# EAGLE design PIC-adresseur (EAGLE 7.2.0)
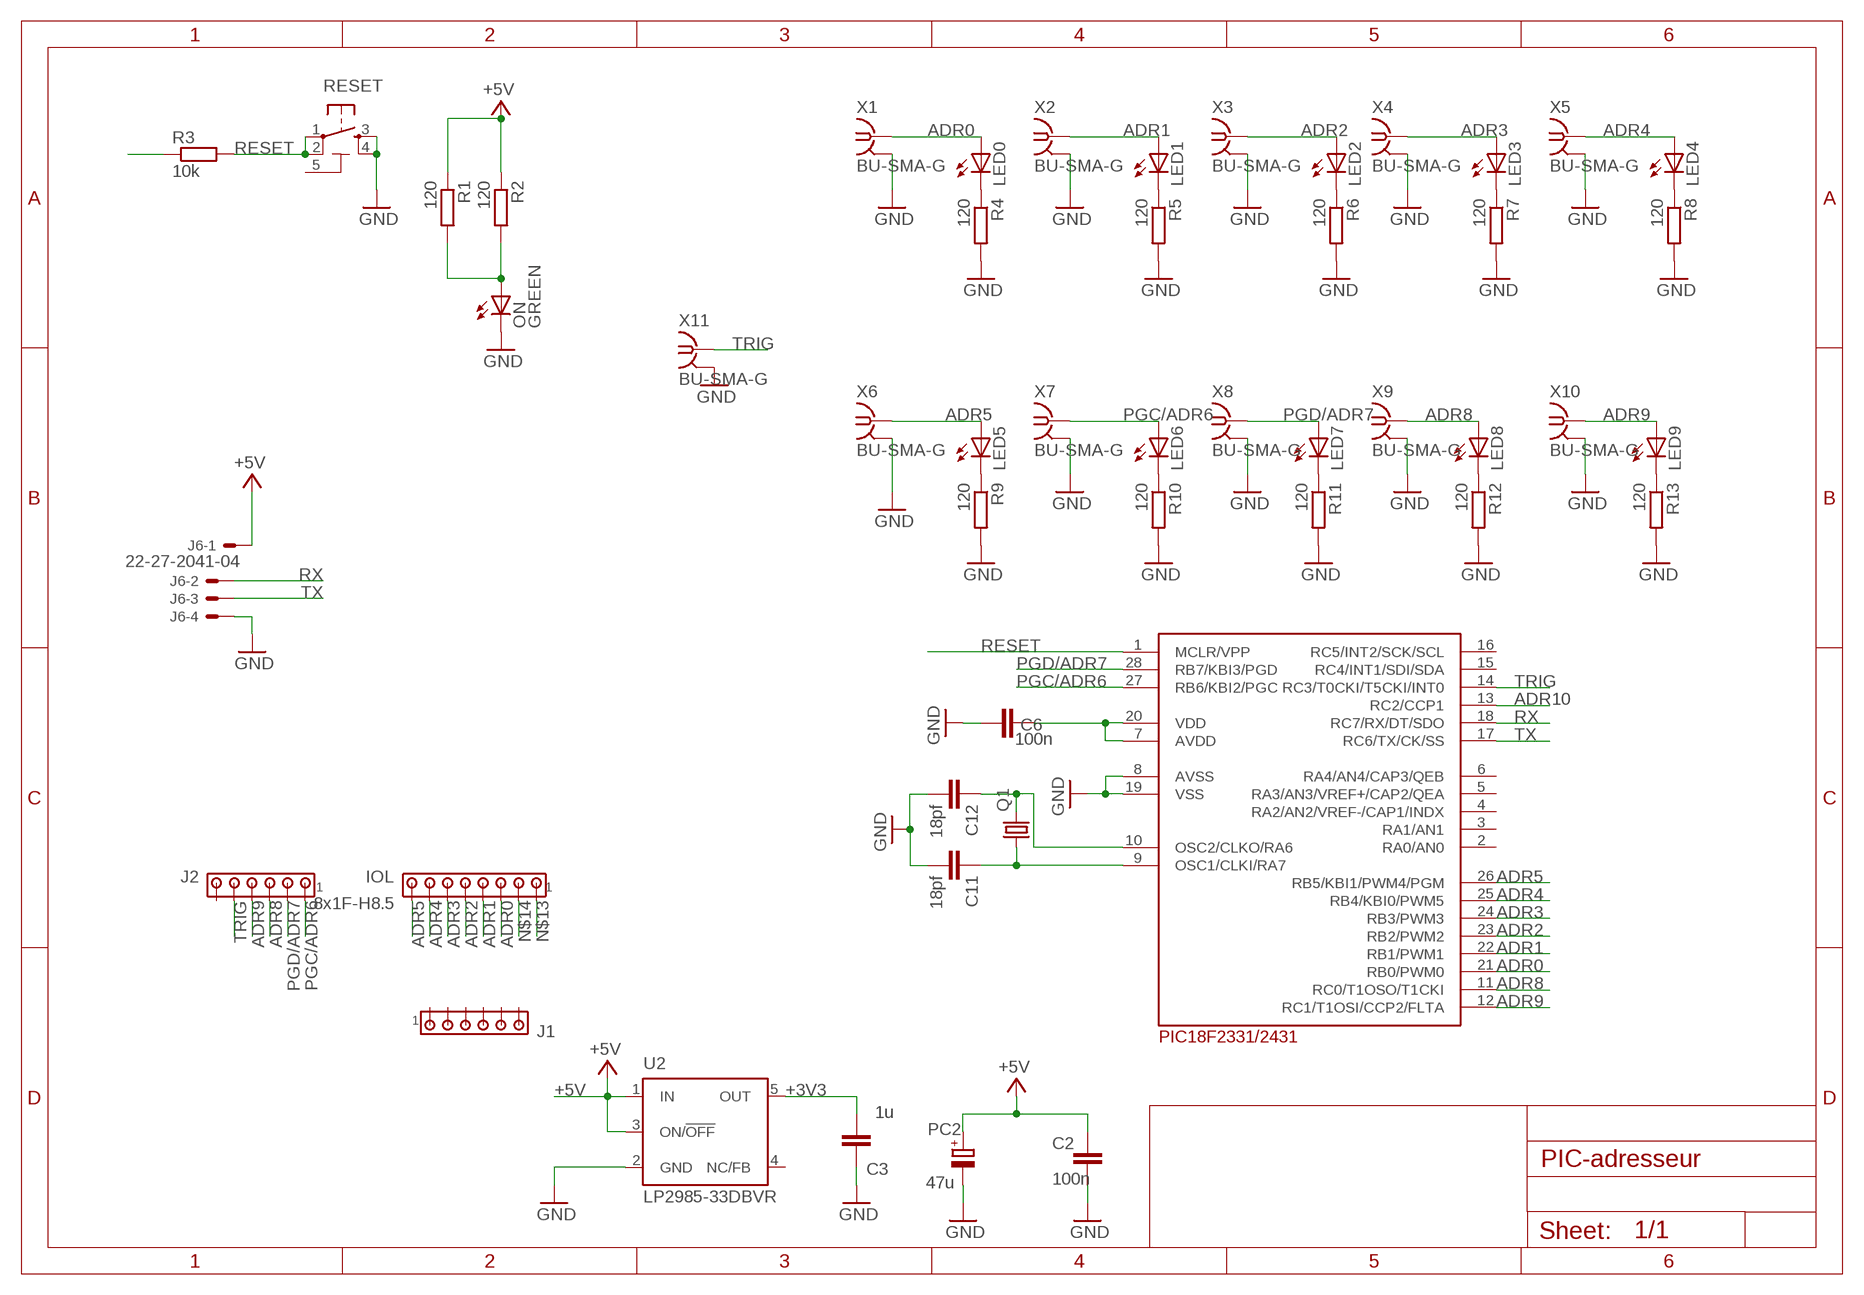
[diagram p0: schematic, sheet 1]

## Parts
C2  100n  C-EU0603-RND  [C0603-ROUND]
C3  1u  C-EU0603-RND  [C0603-ROUND]
C6  100n  C-EUC0603K  [C0603K]
C11  18pf  C-EUC0603  [C0603]
C12  18pf  C-EUC0603  [C0603]
IOL  8x1F-H8.5  MTA08-100  [10X08MTA]
J1  MTA06-100  [10X06MTA]
J2  MTA06-100  [10X06MTA]
J6  22-27-2041-04  [6410-04]
LED0  LEDCHIP-LED0805  [CHIP-LED0805]
LED1  LEDCHIP-LED0805  [CHIP-LED0805]
LED2  LEDCHIP-LED0805  [CHIP-LED0805]
LED3  LEDCHIP-LED0805  [CHIP-LED0805]
LED4  LEDCHIP-LED0805  [CHIP-LED0805]
LED5  LEDCHIP-LED0805  [CHIP-LED0805]
LED6  LEDCHIP-LED0805  [CHIP-LED0805]
LED7  LEDCHIP-LED0805  [CHIP-LED0805]
LED8  LEDCHIP-LED0805  [CHIP-LED0805]
LED9  LEDCHIP-LED0805  [CHIP-LED0805]
ON  GREEN  LEDCHIP-LED0805  [CHIP-LED0805]
PC2  47u  CPOL-EUD  [PANASONIC_D]
Q1  CRYSTALSM49  [SM49]
R1  120  R-EU_R0805  [R0805]
R2  120  R-EU_R0805  [R0805]
R3  10k  R-EU_R0805  [R0805]
R4  120  R-EU_R0805  [R0805]
R5  120  R-EU_R0805  [R0805]
R6  120  R-EU_R0805  [R0805]
R7  120  R-EU_R0805  [R0805]
R8  120  R-EU_R0805  [R0805]
R9  120  R-EU_R0805  [R0805]
R10  120  R-EU_R0805  [R0805]
R11  120  R-EU_R0805  [R0805]
R12  120  R-EU_R0805  [R0805]
R13  120  R-EU_R0805  [R0805]
RESET  TS42031-160R-TR-7260  TS42  [TS42]
U2  LP2985-33DBVR  LP2985-XXDBVR33  [SOT23-DBV]
U$2  PIC18F2331/2431  [DIL28-3]
X1  BU-SMA-G  [BU-SMA-G]
X2  BU-SMA-G  [BU-SMA-G]
X3  BU-SMA-G  [BU-SMA-G]
X4  BU-SMA-G  [BU-SMA-G]
X5  BU-SMA-G  [BU-SMA-G]
X6  BU-SMA-G  [BU-SMA-G]
X7  BU-SMA-G  [BU-SMA-G]
X8  BU-SMA-G  [BU-SMA-G]
X9  BU-SMA-G  [BU-SMA-G]
X10  BU-SMA-G  [BU-SMA-G]
X11  BU-SMA-G  [BU-SMA-G]

## Nets
+3V3: C3.2 C6.2 R3.1 U2.5(OUT) U$2.7(AVDD) U$2.20(VDD)
+5V [usbvcc]: C2.2 J6.1 PC2.+ R1.1 R2.1 U2.1(IN) U2.3(ON/!OFF)
ADR0: IOL.3 LED0.A U$2.21(RB0/PWM0) X1.1
ADR1: IOL.4 LED1.A U$2.22(RB1/PWM1) X2.1
ADR2: IOL.5 LED2.A U$2.23(RB2/PWM2) X3.1
ADR3: IOL.6 LED3.A U$2.24(RB3/PWM3) X4.1
ADR4: IOL.7 LED4.A U$2.25(RB4/KBI0/PWM5) X5.1
ADR5: IOL.8 LED5.A U$2.26(RB5/KBI1/PWM4/PGM) X6.1
ADR8: J2.4 LED8.A U$2.11(RC0/T1OSO/T1CKI) X9.1
ADR9: J2.3 LED9.A U$2.12(RC1/T1OSI/CCP2/FLTA) X10.1
ADR10: U$2.13(RC2/CCP1)
GND [gnd]: C2.1 C3.1 C6.1 C11.2 C12.2 J6.4 ON.C PC2.- R4.2 R5.2 R6.2 R7.2 R8.2 R9.2 R10.2 R11.2 R12.2 R13.2 RESET.3 RESET.4 U2.2(GND) U$2.8(AVSS) U$2.19(VSS) X1.2 X1.3 X1.4 X1.5 X2.2 X2.3 X2.4 X2.5 X3.2 X3.3 X3.4 X3.5 X4.2 X4.3 X4.4 X4.5 X5.2 X5.3 X5.4 X5.5 X6.2 X6.3 X6.4 X6.5 X7.2 X7.3 X7.4 X7.5 X8.2 X8.3 X8.4 X8.5 X9.2 X9.3 X9.4 X9.5 X10.2 X10.3 X10.4 X10.5 X11.2 X11.3 X11.4 X11.5
N$1: LED0.C R4.1
N$2: LED1.C R5.1
N$3: ON.A R1.2 R2.2
N$4: LED2.C R6.1
N$5: LED3.C R7.1
N$7: LED4.C R8.1
N$8: LED5.C R9.1
N$9: LED6.C R10.1
N$10: LED7.C R11.1
N$11: LED8.C R12.1
N$12: LED9.C R13.1
N$13: IOL.1
N$14: IOL.2
PGC/ADR6: J2.6 LED6.A U$2.27(RB6/KBI2/PGC) X7.1
PGD/ADR7: J2.5 LED7.A U$2.28(RB7/KBI3/PGD) X8.1
RESET: R3.2 RESET.1 RESET.2 U$2.1(MCLR/VPP)
RX: J6.2 U$2.18(RC7/RX/DT/SDO)
TRIG: J2.2 U$2.14(RC3/T0CKI/T5CKI/INT0) X11.1
TX: J6.3 U$2.17(RC6/TX/CK/SS)
XTAL1: C12.1 Q1.2 U$2.10(OSC2/CLKO/RA6)
XTAL2: C11.1 Q1.1 U$2.9(OSC1/CLKI/RA7)
Unconnected: J1.1 J1.2 J1.3 J1.4 J1.5 J1.6 J2.1 U2.4(NC/FB) U$2.2(RA0/AN0) U$2.3(RA1/AN1) U$2.4(RA2/AN2/VREF-/CAP1/INDX) U$2.5(RA3/AN3/VREF+/CAP2/QEA) U$2.6(RA4/AN4/CAP3/QEB) U$2.15(RC4/INT1/SDI/SDA) U$2.16(RC5/INT2/SCK/SCL)

## Power pins joined to a net without a drawn wire
5-GND: RESET.5(5-GND)

## Library data of the parts
C2 C6 = SmartPrj:C-EU: CAPACITOR, European symbol; OC_FARNELL: 2210925
C3 = SmartPrj:C-EU: CAPACITOR, European symbol; OC_FARNELL: 2346901
C11 C12 = LibPerso:C-EU: CAPACITOR, European symbol; OC_FARNELL: 1740598
IOL = LibPerso:MTA08-100: AMP connector; OC_FARNELL: 1593416
J1 J2 = LibPerso:MTA06-100: AMP connector; OC_FARNELL: 1593415
J6 = con-molex:22-?-04: CONNECTOR wire to board 2.54 mm (.1 inch) pitch header; OC_FARNELL: unknown; OC_NEWARK: unknown
LED0 LED1-LED9 = LibPerso:LED: LED OSRAM: - CHIPLED LG R971, LG N971, LY N971, LG Q971, LY Q971, LO R971, LY R971 LH N974, LH R974 LS Q976, LO Q976, LY Q976 LO Q996 - Hyper CHIPLED LW Q18S LB Q993, LB Q99A, LB R99A - SideLED LS A670, LO A670, LY A670, LG A670, LP A670 LB A673, LV A673, LT A673, LW A673 LH A674 LY A675 LS A676, LA A676, LO A676, LY A676, LW A676 LS A679, LY A679, LG A679 - Hyper Micro SIDELED® LS Y876, LA Y876, LO Y876, LY Y876 LT Y87S - SmartLED LW L88C, LW L88S LB L89C, LB L89S, LG L890 LS L89K, LO L89K, LY L89K LS L896, LA L896, LO L896, LY L896 - TOPLED LS T670, LO T670, LY T670, LG T670, LP T670 LSG T670, LSP T670, LSY T670, LOP T670, LYG T670 LG T671, LOG T671, LSG T671 LB T673, LV T673, LT T673, LW T673 LH T674 LS T676, LA T676, LO T676, LY T676, LB T676, LH T676, LSB T676, LW T676 LB T67C, LV T67C, LT T67C, LS T67K, LO T67K, LY T67K, LW E67C LS E67B, LA E67B, LO E67B, LY E67B, LB E67C, LV E67C, LT E67C LW T67C LS T679, LY T679, LG T679 LS T770, LO T770, LY T770, LG T770, LP T770 LB T773, LV T773, LT T773, LW T773 LH T774 LS E675, LA E675, LY E675, LS T675 LS T776, LA T776, LO T776, LY T776, LB T776 LHGB T686 LT T68C, LB T68C - Hyper Mini TOPLED® LB M676 - Mini TOPLED Santana® LG M470 LS M47K, LO M47K, LY M47K Source: http://www.osram.convergy.de LUXEON: - LUMILED® LXK2-PW12-R00, LXK2-PW12-S00, LXK2-PW14-U00, LXK2-PW14-V00 LXK2-PM12-R00, LXK2-PM12-S00, LXK2-PM14-U00 LXK2-PE12-Q00, LXK2-PE12-R00, LXK2-PE12-S00, LXK2-PE14-T00, LXK2-PE14-U00 LXK2-PB12-K00, LXK2-PB12-L00, LXK2-PB12-M00, LXK2-PB14-N00, LXK2-PB14-P00, LXK2-PB14-Q00 LXK2-PR12-L00, LXK2-PR12-M00, LXK2-PR14-Q00, LXK2-PR14-R00 LXK2-PD12-Q00, LXK2-PD12-R00, LXK2-PD12-S00 LXK2-PH12-R00, LXK2-PH12-S00 LXK2-PL12-P00, LXK2-PL12-Q00, LXK2-PL12-R00 Source: www.luxeon.com KINGBRIGHT: KA-3528ASYC Source: www.kingbright.com; OC_FARNELL: 8529906
ON = led:LED: LED OSRAM: - CHIPLED LG R971, LG N971, LY N971, LG Q971, LY Q971, LO R971, LY R971 LH N974, LH R974 LS Q976, LO Q976, LY Q976 LO Q996 - Hyper CHIPLED LW Q18S LB Q993, LB Q99A, LB R99A - SideLED LS A670, LO A670, LY A670, LG A670, LP A670 LB A673, LV A673, LT A673, LW A673 LH A674 LY A675 LS A676, LA A676, LO A676, LY A676, LW A676 LS A679, LY A679, LG A679 - Hyper Micro SIDELED® LS Y876, LA Y876, LO Y876, LY Y876 LT Y87S - SmartLED LW L88C, LW L88S LB L89C, LB L89S, LG L890 LS L89K, LO L89K, LY L89K LS L896, LA L896, LO L896, LY L896 - TOPLED LS T670, LO T670, LY T670, LG T670, LP T670 LSG T670, LSP T670, LSY T670, LOP T670, LYG T670 LG T671, LOG T671, LSG T671 LB T673, LV T673, LT T673, LW T673 LH T674 LS T676, LA T676, LO T676, LY T676, LB T676, LH T676, LSB T676, LW T676 LB T67C, LV T67C, LT T67C, LS T67K, LO T67K, LY T67K, LW E67C LS E67B, LA E67B, LO E67B, LY E67B, LB E67C, LV E67C, LT E67C LW T67C LS T679, LY T679, LG T679 LS T770, LO T770, LY T770, LG T770, LP T770 LB T773, LV T773, LT T773, LW T773 LH T774 LS E675, LA E675, LY E675, LS T675 LS T776, LA T776, LO T776, LY T776, LB T776 LHGB T686 LT T68C, LB T68C - Hyper Mini TOPLED® LB M676 - Mini TOPLED Santana® LG M470 LS M47K, LO M47K, LY M47K Source: http://www.osram.convergy.de LUXEON: - LUMILED® LXK2-PW12-R00, LXK2-PW12-S00, LXK2-PW14-U00, LXK2-PW14-V00 LXK2-PM12-R00, LXK2-PM12-S00, LXK2-PM14-U00 LXK2-PE12-Q00, LXK2-PE12-R00, LXK2-PE12-S00, LXK2-PE14-T00, LXK2-PE14-U00 LXK2-PB12-K00, LXK2-PB12-L00, LXK2-PB12-M00, LXK2-PB14-N00, LXK2-PB14-P00, LXK2-PB14-Q00 LXK2-PR12-L00, LXK2-PR12-M00, LXK2-PR14-Q00, LXK2-PR14-R00 LXK2-PD12-Q00, LXK2-PD12-R00, LXK2-PD12-S00 LXK2-PH12-R00, LXK2-PH12-S00 LXK2-PL12-P00, LXK2-PL12-Q00, LXK2-PL12-R00 Source: www.luxeon.com KINGBRIGHT: KA-3528ASYC Source: www.kingbright.com; OC_FARNELL: 8529906
PC2 = rcl:CPOL-EU: POLARIZED CAPACITOR, European symbol; OC_FARNELL: 1850100
Q1 = crystal:CRYSTAL: CRYSTAL; OC_FARNELL: 1842332; OC_NEWARK: unknown
R1-R3 = LibPerso:R-EU_: RESISTOR, European symbol; OC_FARNELL: 9331697
R4-R13 = LibPerso:R-EU_: RESISTOR, European symbol; OC_FARNELL: 2447561
RESET = SmartPrj:TS42: TS42 Dongnan Electronics Tact switch VDC 12V - 50mA; OC_FARNELL: 2060823
U2 = SmartPrj:LP2985-XXDBVR: ULTRALOW-POWER 50-mA LOW-DROPOUT LINEAR REGULATORS 50-mA Low-Dropout Regulator Source: http://focus.ti.com/lit/ds/symlink/tps77001.pdf; OC_FARNELL: 2395925
U$2 = LibPerso:PIC18F2331/2431; OC_FARNELL: 1212693
X1-X11 = con-coax:BU-SMA-G: FEMALE SMA CONNECTOR Radiall distributor RS 193-9117; OC_FARNELL: unknown; OC_NEWARK: unknown

## Net classes
0 default: width 0.254 mm, clearance 0.254 mm
1 power: width 0.61 mm, drill 0.61 mm, clearance 0.254 mm
2 gnd: width 0.305 mm, drill 0.559 mm, clearance 0.254 mm
3 usbvcc: width 0.508 mm, drill 0.61 mm, clearance 0.254 mm
4 aref: width 0.406 mm, drill 0.61 mm, clearance 0.254 mm

## Board
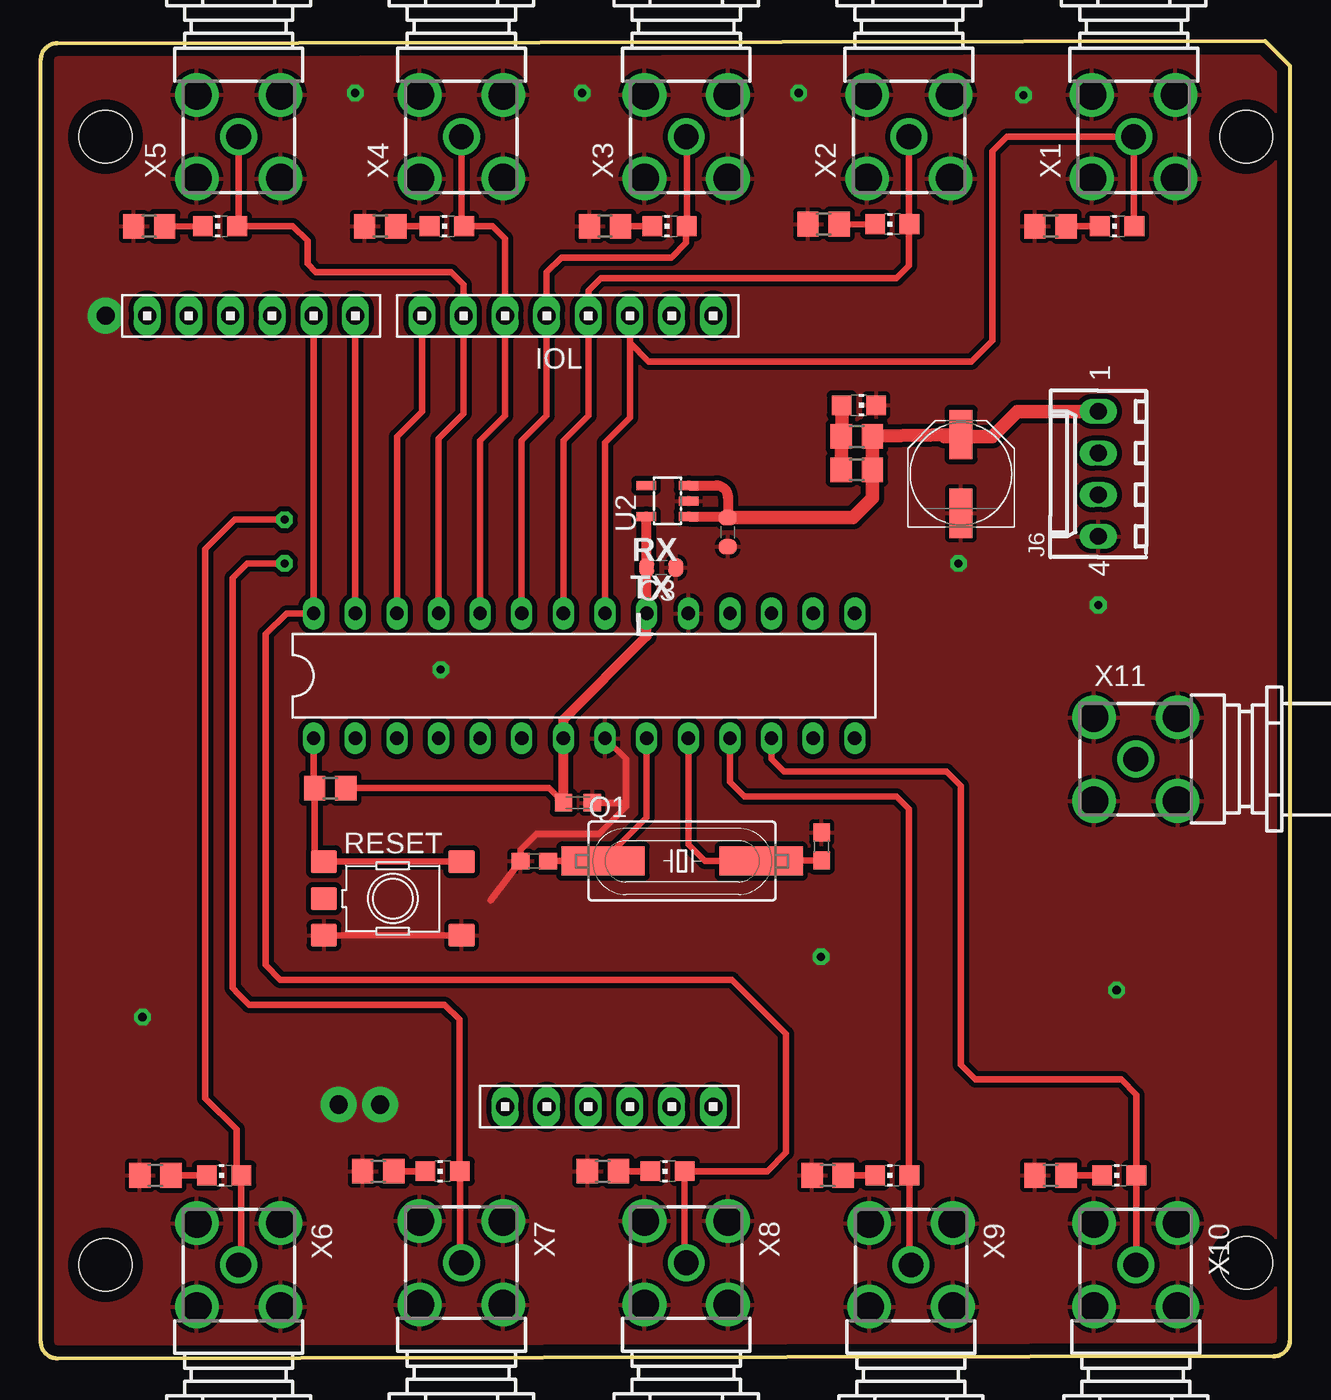
[diagram p1: board, top side]
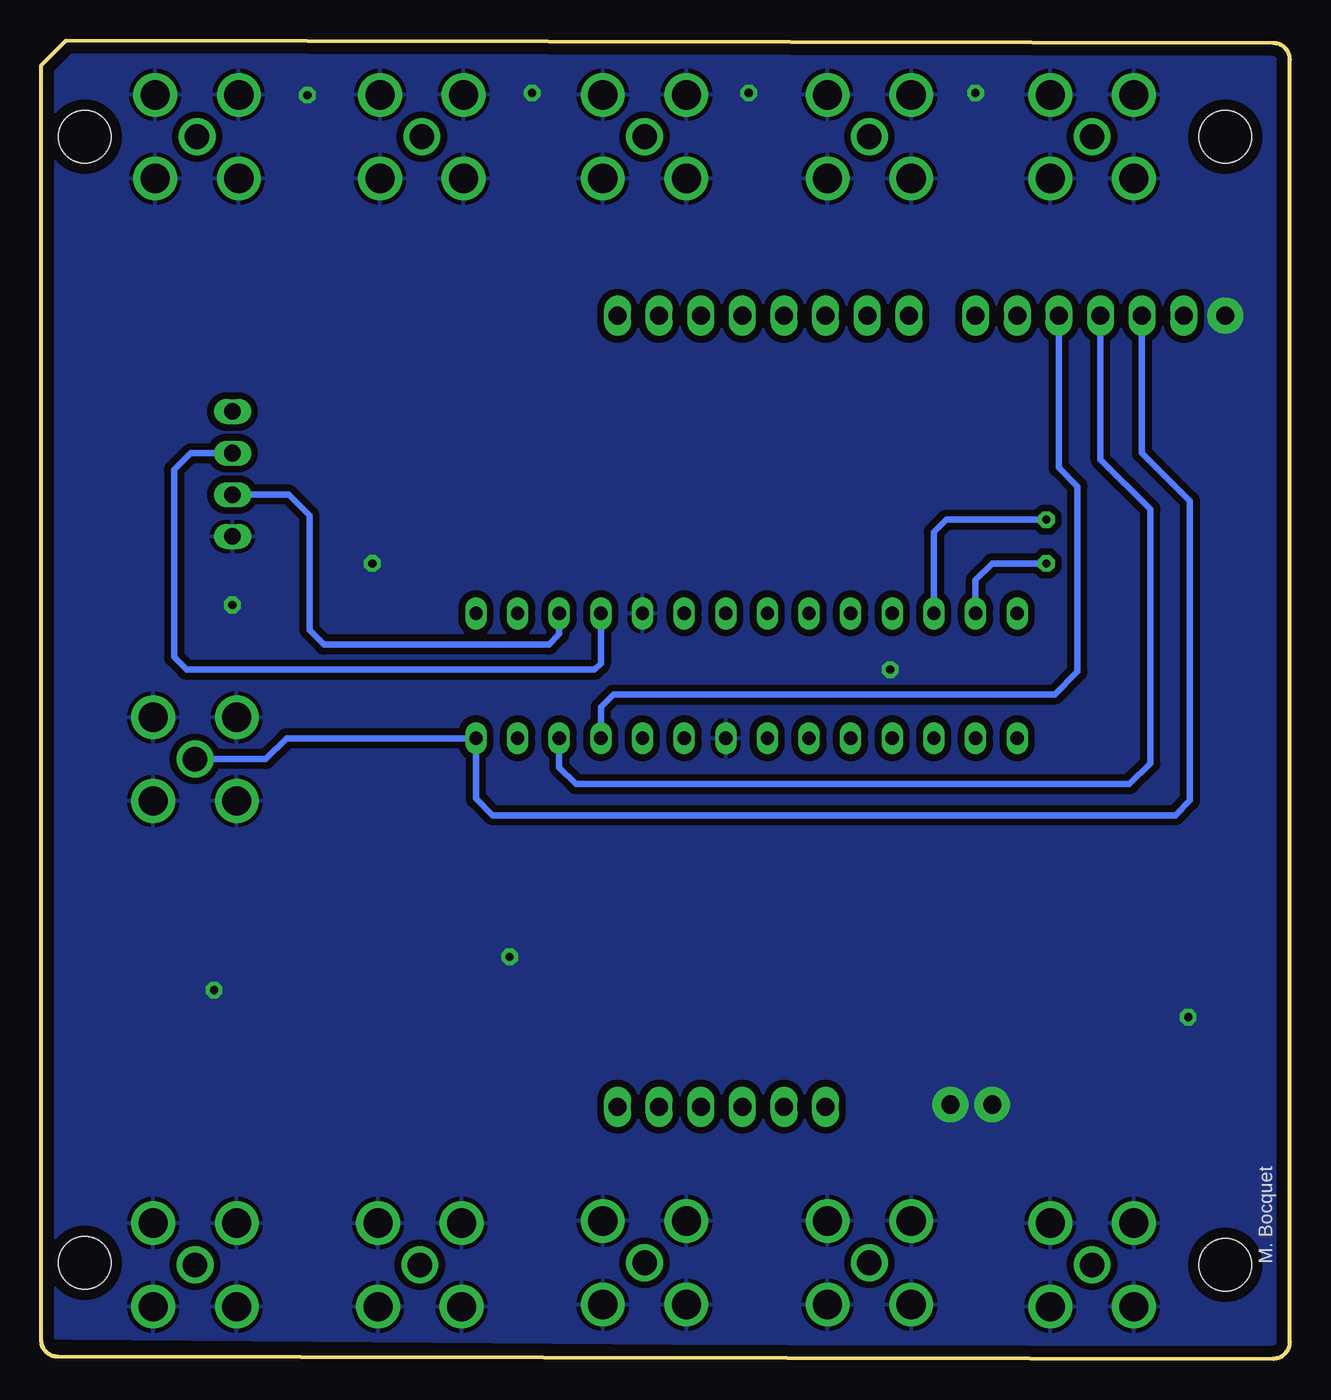
[diagram p2: board, bottom side, seen from below]

Size 76.2 x 80.39 mm. Coordinates in mm from the lower left corner, seen from the top.
Outline: 74.68,80.39 76.2,78.87 76.2,1.13 arc-90 75.2,0.13 1,0 arc-90 0,1 0,79.26 arc-90 1,80.26 74.68,80.39
Copper layers (1*16): Top 0.035mm / dielectric 1.5mm / Bottom 0.035mm
Design rules "default *": minimum track width 10mil, minimum drill 22mil, track to track 10mil, track to pad 10mil, pad to pad 10mil, via to via 12mil, smd to smd 8mil, copper to edge 26mil, drill to drill 12mil, minimum pad ring 10mil, minimum via ring 10mil, stop-mask expansion 1mil, vias tented up to drill 30mil, thermal gap 10mil
Holes 3.2 mm at 73.53,74.55 73.53,5.84 3.94,5.71 3.94,74.55

### Footprints (pad centres in the part's own frame; a part is rotated, then mirrored left to right if it is on the bottom)
C0603-ROUND = smd 0.898 x 1.1: 1 -0.889,0; 2 0.889,0
C0603K = smd 1.05 x 1.08: 1 -0.875,0; 2 0.875,0
C0603 = smd 1.1 x 1: 1 -0.85,0; 2 0.85,0
10X08MTA = drill 1.1 long: 1 8.89,0; 2 6.35,0; 3 3.81,0; 4 1.27,0; 5 -1.27,0; 6 -3.81,0; 7 -6.35,0; 8 -8.89,0
10X06MTA = drill 1.1 long: 1 6.35,0; 2 3.81,0; 3 1.27,0; 4 -1.27,0; 5 -3.81,0; 6 -6.35,0
6410-04 = drill 1.016 long: 1 3.81,0; 2 1.27,0; 3 -1.27,0; 4 -3.81,0
CHIP-LED0805 = smd 1.2 x 1.2: A 0,-1.05; C 0,1.05
PANASONIC_D = smd 3 x 1.4: + 2.4,0; - -2.4,0
SM49 = smd 5.08 x 1.778: 1 -4.826,0; 2 4.826,0
R0805 = smd 1.3 x 1.5: 1 -0.95,0; 2 0.95,0
TS42 = smd 1.6 x 1.4: 1 -4.2,2.25; 2 4.2,2.25; 3 -4.2,-2.25; 4 4.2,-2.25; 5 -4.2,0
SOT23-DBV = smd 0.55 x 1.2: 1 -0.95,-1.3; 2 0,-1.3; 3 0.95,-1.3; 4 0.95,1.3; 5 -0.95,1.3
DIL28-3 = drill 0.813 long: 1 -16.51,-3.81; 2 -13.97,-3.81; 3 -11.43,-3.81; 4 -8.89,-3.81; 5 -6.35,-3.81; 6 -3.81,-3.81; 7 -1.27,-3.81; 8 1.27,-3.81; 9 3.81,-3.81; 10 6.35,-3.81; 11 8.89,-3.81; 12 11.43,-3.81; 13 13.97,-3.81; 14 16.51,-3.81; 15 16.51,3.81; 16 13.97,3.81; 17 11.43,3.81; 18 8.89,3.81; 19 6.35,3.81; 20 3.81,3.81; 21 1.27,3.81; 22 -1.27,3.81; 23 -3.81,3.81; 24 -6.35,3.81; 25 -8.89,3.81; 26 -11.43,3.81; 27 -13.97,3.81; 28 -16.51,3.81
BU-SMA-G = drill 1.5: 1 0,0 | drill 1.778: 2 -2.55,2.55; 3 2.55,2.55; 4 2.55,-2.55; 5 -2.55,-2.55

### Placement (x,y rotation side)
C2  41.91,50.42 90 top
C3  37.85,48.26 180 top
C6  32.77,33.91 180 top
C11  30.1,30.35 180 top
C12  47.62,31.24 90 top
IOL  32.13,63.63 0 top
J1  34.67,15.37 0 top
J2  12.83,63.63 180 top
J6  64.52,53.98 90 top
LED0  65.66,69.09 90 top
LED1  51.94,69.22 90 top
LED2  38.35,69.09 90 top
LED3  24.77,69.09 90 top
LED4  10.92,69.09 90 top
LED5  11.18,11.18 90 top
LED6  24.51,11.43 90 top
LED7  38.23,11.43 90 top
LED8  51.94,11.18 90 top
LED9  65.79,11.18 90 top
ON  49.91,58.17 270 top
PC2  56.13,53.98 90 top
Q1  39.12,30.35 0 top
R1  49.78,56.26 180 top
R2  49.78,54.23 180 top
R3  17.65,34.8 180 top
R4  61.59,69.09 180 top
R5  47.75,69.22 180 top
R6  34.42,69.09 180 top
R7  20.7,69.09 180 top
R8  6.6,69.09 180 top
R9  6.99,11.18 180 top
R10  20.57,11.43 180 top
R11  34.29,11.43 180 top
R12  48.01,11.18 180 top
R13  61.59,11.18 180 top
RESET  21.46,28.07 0 top
U2  38.23,52.32 90 top
U$2  33.15,41.66 0 top
X1  66.67,74.55 90 top
X2  52.96,74.55 90 top
X3  39.37,74.55 90 top
X4  25.65,74.55 90 top
X5  12.07,74.55 90 top
X6  12.07,5.71 270 top
X7  25.65,5.84 270 top
X8  39.37,5.84 270 top
X9  53.09,5.71 270 top
X10  66.8,5.71 270 top
X11  66.8,36.58 0 top

### Tracks (layer width: path | path; a pad name or v marks a point on that pad's centre or on a via)
+3V3
  Top 0.406: R3.1 31,34.8 C6.2
  Top 0.61: C6.2 31.89,37.83 U$2.7 31.88,38.99 36.96,44.07 U$2.20 C3.2 36.96,51.34 U2.5
+5V
  Top 0.61: U2.1 41.84,51.37 arc-90 C2.2 41.91,52.58 arc90 41.21,53.27 U2.3
  Top 0.813: J6.1 59.56,57.78 58.04,56.26 55.13,56.26 PC2.+ 50.75,56.27 R1.1 R2.1 50.73,52.51 49.53,51.31 C2.2
ADR0
  Top 0.406: LED0.A 66.67,69.12 X1.1 58.93,74.55 58.04,73.66 58.04,62.1 56.77,60.83 37.08,60.83 35.94,61.98 IOL.3 35.94,57.4 34.42,55.88 U$2.21
ADR1
  Top 0.406: X2.1 52.96,69.25 LED1.A 52.96,69.22 52.96,66.68 52.2,65.91 34.16,65.91 33.4,65.15 IOL.4 33.4,57.53 31.88,56.01 U$2.22
ADR2
  Top 0.406: X3.1 39.4,74.52 LED2.A 39.37,69.05 39.37,68.07 38.48,67.18 31.75,67.18 30.86,66.29 IOL.5 30.86,57.53 29.34,56.01 U$2.23
ADR3
  Top 0.406: X4.1 25.65,69.25 LED3.A 27.56,69.09 28.32,68.33 IOL.6 28.32,57.53 26.8,56.01 U$2.24
ADR4
  Top 0.406: X5.1 12.07,69.18 LED4.A 15.37,69.09 16.26,68.2 16.26,66.8 16.76,66.29 25.02,66.29 25.78,65.53 IOL.7 25.78,57.66 24.26,56.13 U$2.25
ADR5  (via drill 0.5 pad 1.02)
  Top 0.406: IOL.8 23.24,57.78 21.72,56.26 U$2.26 | X6.1 12.23,5.88 LED5.A 11.94,11.46 11.94,13.97 10.03,15.88 10.03,49.4 11.81,51.18 v14.86,51.18
  Bottom 0.406: v14.86,51.18 20.96,51.18 21.72,50.42 U$2.26
ADR8
  Top 0.406: X9.1 52.99,5.81 LED8.A 52.96,11.21 52.96,33.53 52.2,34.29 42.93,34.29 42.04,35.18 U$2.11
  Bottom 0.406: U$2.11 42.04,39.75 41.27,40.51 14.35,40.51 12.95,41.91 12.95,53.21 14.1,54.36 J2.4
ADR9
  Top 0.406: X10.1 66.84,5.75 LED9.A 66.84,16.09 65.91,17.02 57.02,17.02 56.13,17.91 56.13,34.92 55.24,35.81 45.34,35.81 44.58,36.58 U$2.12
  Bottom 0.406: U$2.12 44.58,36.07 43.56,35.05 9.78,35.05 8.51,36.32 8.51,51.82 11.56,54.86 J2.3
GND  (via drill 0.5 pad 0.81, 1.1 pad 2.18)
  Top 0.406: 27.43,27.94 C11.2 29.25,31.03 30.23,32 34.04,32 35.69,33.66 35.69,33.91 | U$2.8 35.69,36.58 35.69,33.91 | C6.1 35.69,33.91 | RESET.4 RESET.3
  other vias: 19.18,77.22 46.23,77.22 55.98,48.51 33.02,77.22 6.2,20.83 64.52,45.97 65.63,22.48 24.38,42.04 59.94,77.09 3.94,63.63 47.6,24.51 20.7,15.49 18.16,15.49
  pour Bottom (isolate 0.406, rank 2): 0.63,79.63 77.85,79.76 77.98,80.01 77.98,1.27 0.89,0.64 0.63,0.89
  pour Top (isolate 0.305, rank 2): 0.63,79.63 77.98,79.76 77.98,0.76 0.63,0.64 0.51,30.48
N$1
  Top 0.406: R4.1 LED0.C
N$2
  Top 0.406: LED1.C 50.87,69.19 R5.1
N$3
  Top 0.813: ON.A 48.86,56.29 R1.2 R2.2
N$4
  Top 0.406: R6.1 LED2.C
N$5
  Top 0.406: R7.1 LED3.C
N$7
  Top 0.406: LED4.C 9.84,69.06 R8.1
N$8
  Top 0.406: LED5.C R9.1
N$9
  Top 0.406: R10.1 LED6.C
N$10
  Top 0.406: R11.1 LED7.C
N$11
  Top 0.406: R12.1 LED8.C
N$12
  Top 0.406: R13.1 LED9.C
PGC/ADR6  (via drill 0.5 pad 1.02)
  Top 0.406: U$2.27 J2.6 | X7.1 25.56,5.94 LED6.A 25.53,11.46 25.53,20.7 24.64,21.59 12.7,21.59 12.07,22.22 11.68,22.61 11.68,47.62 12.57,48.51 v14.86,48.51
  Bottom 0.406: v14.86,48.51 18.16,48.51 19.18,47.5 U$2.27
PGD/ADR7
  Top 0.406: J2.5 U$2.28 14.99,45.47 13.72,44.2 13.72,24 14.61,23.11 42.16,23.11 45.47,19.81 45.47,12.57 44.32,11.43 LED7.A 39.28,5.94 X8.1
RESET
  Top 0.406: U$2.1 16.64,34.86 R3.2 16.7,30.88 RESET.1 RESET.2
RX
  Bottom 0.406: U$2.18 42.04,42.42 42.42,42.04 67.31,42.04 68.07,42.8 68.07,54.23 67.06,55.24 J6.2
TRIG
  Bottom 0.406: X11.1 62.48,36.58 61.21,37.85 U$2.14 49.66,34.16 48.64,33.15 6.99,33.15 6.1,34.04 6.1,52.32 9.02,55.24 J2.2
TX
  Bottom 0.406: U$2.17 44.58,44.2 45.21,43.56 58.93,43.56 59.82,44.45 59.82,51.44 61.09,52.7 J6.3
XTAL1
  Top 0.406: C12.1 43.98,30.39 Q1.2 40.51,30.35 39.5,31.37 U$2.10
XTAL2
  Top 0.406: C11.1 Q1.1 36.96,33.02 U$2.9

### Text on the board
tNames: RX | TX | L
bNames: M. Bocquet
214bmp: D:/SmartProjects/Snc/a4_bn_logo2.bmp